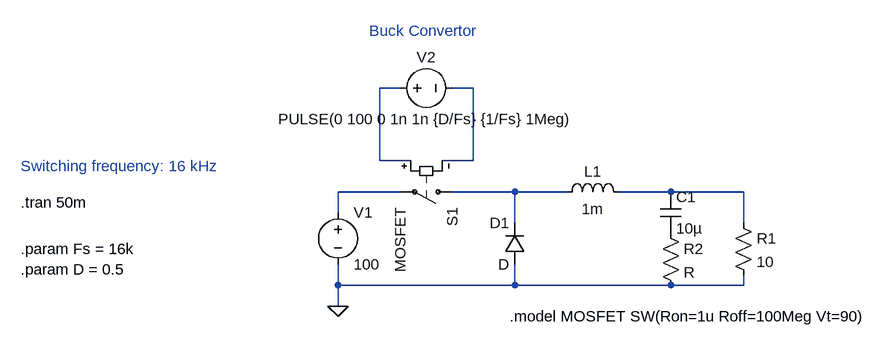
[diagram p0: schematic Buck-converter.asc]
Buck-converter.asc, the LTspice schematic file:
Version 4.1
SHEET 1 1244 680
WIRE 96 -64 64 -64
WIRE 208 -64 176 -64
WIRE 64 48 64 -64
WIRE 112 48 64 48
WIRE 208 48 208 -64
WIRE 208 48 160 48
WIRE 96 96 0 96
WIRE 272 96 176 96
WIRE 352 96 272 96
WIRE 512 96 432 96
WIRE 624 96 512 96
WIRE 0 128 0 96
WIRE 272 144 272 96
WIRE 624 144 624 96
WIRE 0 240 0 208
WIRE 272 240 272 208
WIRE 272 240 0 240
WIRE 512 240 272 240
WIRE 624 240 624 224
WIRE 624 240 512 240
WIRE 0 272 0 240
FLAG 0 272 0
SYMBOL voltage 0 112 R0
WINDOW 123 0 0 Left 0
WINDOW 39 0 0 Left 0
SYMATTR InstName V1
SYMATTR Value 100
SYMBOL diode 288 208 R180
WINDOW 0 24 64 Left 2
WINDOW 3 24 0 Left 2
SYMATTR InstName D1
SYMBOL ind 336 112 R270
WINDOW 0 32 56 VTop 2
WINDOW 3 5 56 VBottom 2
SYMATTR InstName L1
SYMATTR Value 1m
SYMBOL res 608 128 R0
SYMATTR InstName R1
SYMATTR Value 10
SYMBOL sw 192 96 R90
SYMATTR InstName S1
SYMATTR Value MOSFET
SYMBOL voltage 80 -64 R270
WINDOW 0 32 56 VTop 2
WINDOW 3 -32 56 VBottom 2
WINDOW 123 0 0 Left 0
WINDOW 39 0 0 Left 0
SYMATTR InstName V2
SYMATTR Value PULSE(0 100 0 1n 1n {D/Fs} {1/Fs} 1Meg)
SYMBOL cap 496 96 R0
SYMATTR InstName C1
SYMATTR Value 10µ
SYMBOL res 496 144 R0
SYMATTR InstName R2
TEXT -488 112 Left 2 !.tran 50m
TEXT 264 288 Left 2 !.model MOSFET SW(Ron=1u Roff=100Meg Vt=90)
TEXT -488 56 Left 2 ;Switching frequency: 16 kHz
TEXT -488 184 Left 2 !.param Fs = 16k\n.param D = 0.5
TEXT 48 -152 Left 2 ;Buck Convertor

The netlist it stands for:
* Buck-converter.asc
V1 N003 0 100
D1 0 N004 D
L1 N004 N005 1m
R1 N005 0 10
S1 N004 N003 N001 N002 MOSFET
V2 N001 N002 PULSE(0 100 0 1n 1n {D/Fs} {1/Fs} 1Meg)
C1 N005 P001 10µ
R2 P001 0 R
.model D D
.lib standard.dio
.tran 50m
.model MOSFET SW(Ron=1u Roff=100Meg Vt=90)
* Switching frequency: 16 kHz
.param Fs = 16k
.param D = 0.5
* Buck Convertor
.backanno
.end